# Altium schematic sheet Oscillateur.SchDoc
size A
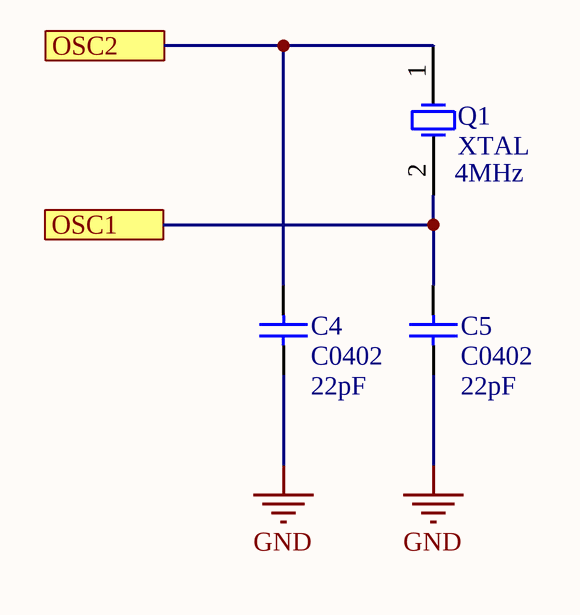
[diagram p0: Oscillateur.SchDoc]

## Parts
C4  C0402  value 22pF  [0402]
C5  C0402  value 22pF  [0402]
Q1  XTAL  value 4MHz  [R38]

## Ports
OSC1, OSC2

## Nets
GND: C4.1 C5.1
OSC1: C5.2 Q1.2(OSC2) ; port OSC1
OSC2: C4.2 Q1.1(OSC1) ; port OSC2

## Library data of the parts
C4 C5 = C0402: Ceramic Chip Capacitor - Standard; Note: Footprint corresponds to dimensions for bulk cassette packaging. This case size has tightened tolerances.; Published: 17-Jul-2002; LatestRevisionDate: 19-Mar-2004; LatestRevisionNote: Silkscreen size reduced.; DatasheetDocument: Mar-2001; PackageDocument: Mar-2001; PackageReference: 0402; Publisher: Altium Limited; Code_JEITA: 0402; Code_IPC: 1005 [0402]; ComponentLink1Description: Manufacturer Link; ComponentLink1URL: http://www.kemet.com/; ComponentLink2Description: Datasheet; ComponentLink2URL: http://www.kemet.com/kemet/web/homepage/kechome.nsf/vapubfilesname/F3102TA.pdf/$file/F3102TA.pdf
Q1 = XTAL: Crystal Oscillator; Published: 8-Jun-2000; LatestRevisionDate: 17-Jul-2002; LatestRevisionNote: Re-released for DXP Platform.; PackageReference: R38; Publisher: Altium Limited; PackageDescription: Crystal, Thru-Hole; 2 Leads; Body 3.1 x 8.2 mm (Dia.xH)